# Altium schematic sheet Fri3D_2020_03.SchDoc: Top Level
size A3; Date: 06/06/2022; DrawnBy: Wim Van Gool; DocumentNumber: 1; Revision: 03; SheetNumber: 1; SheetTotal: 4
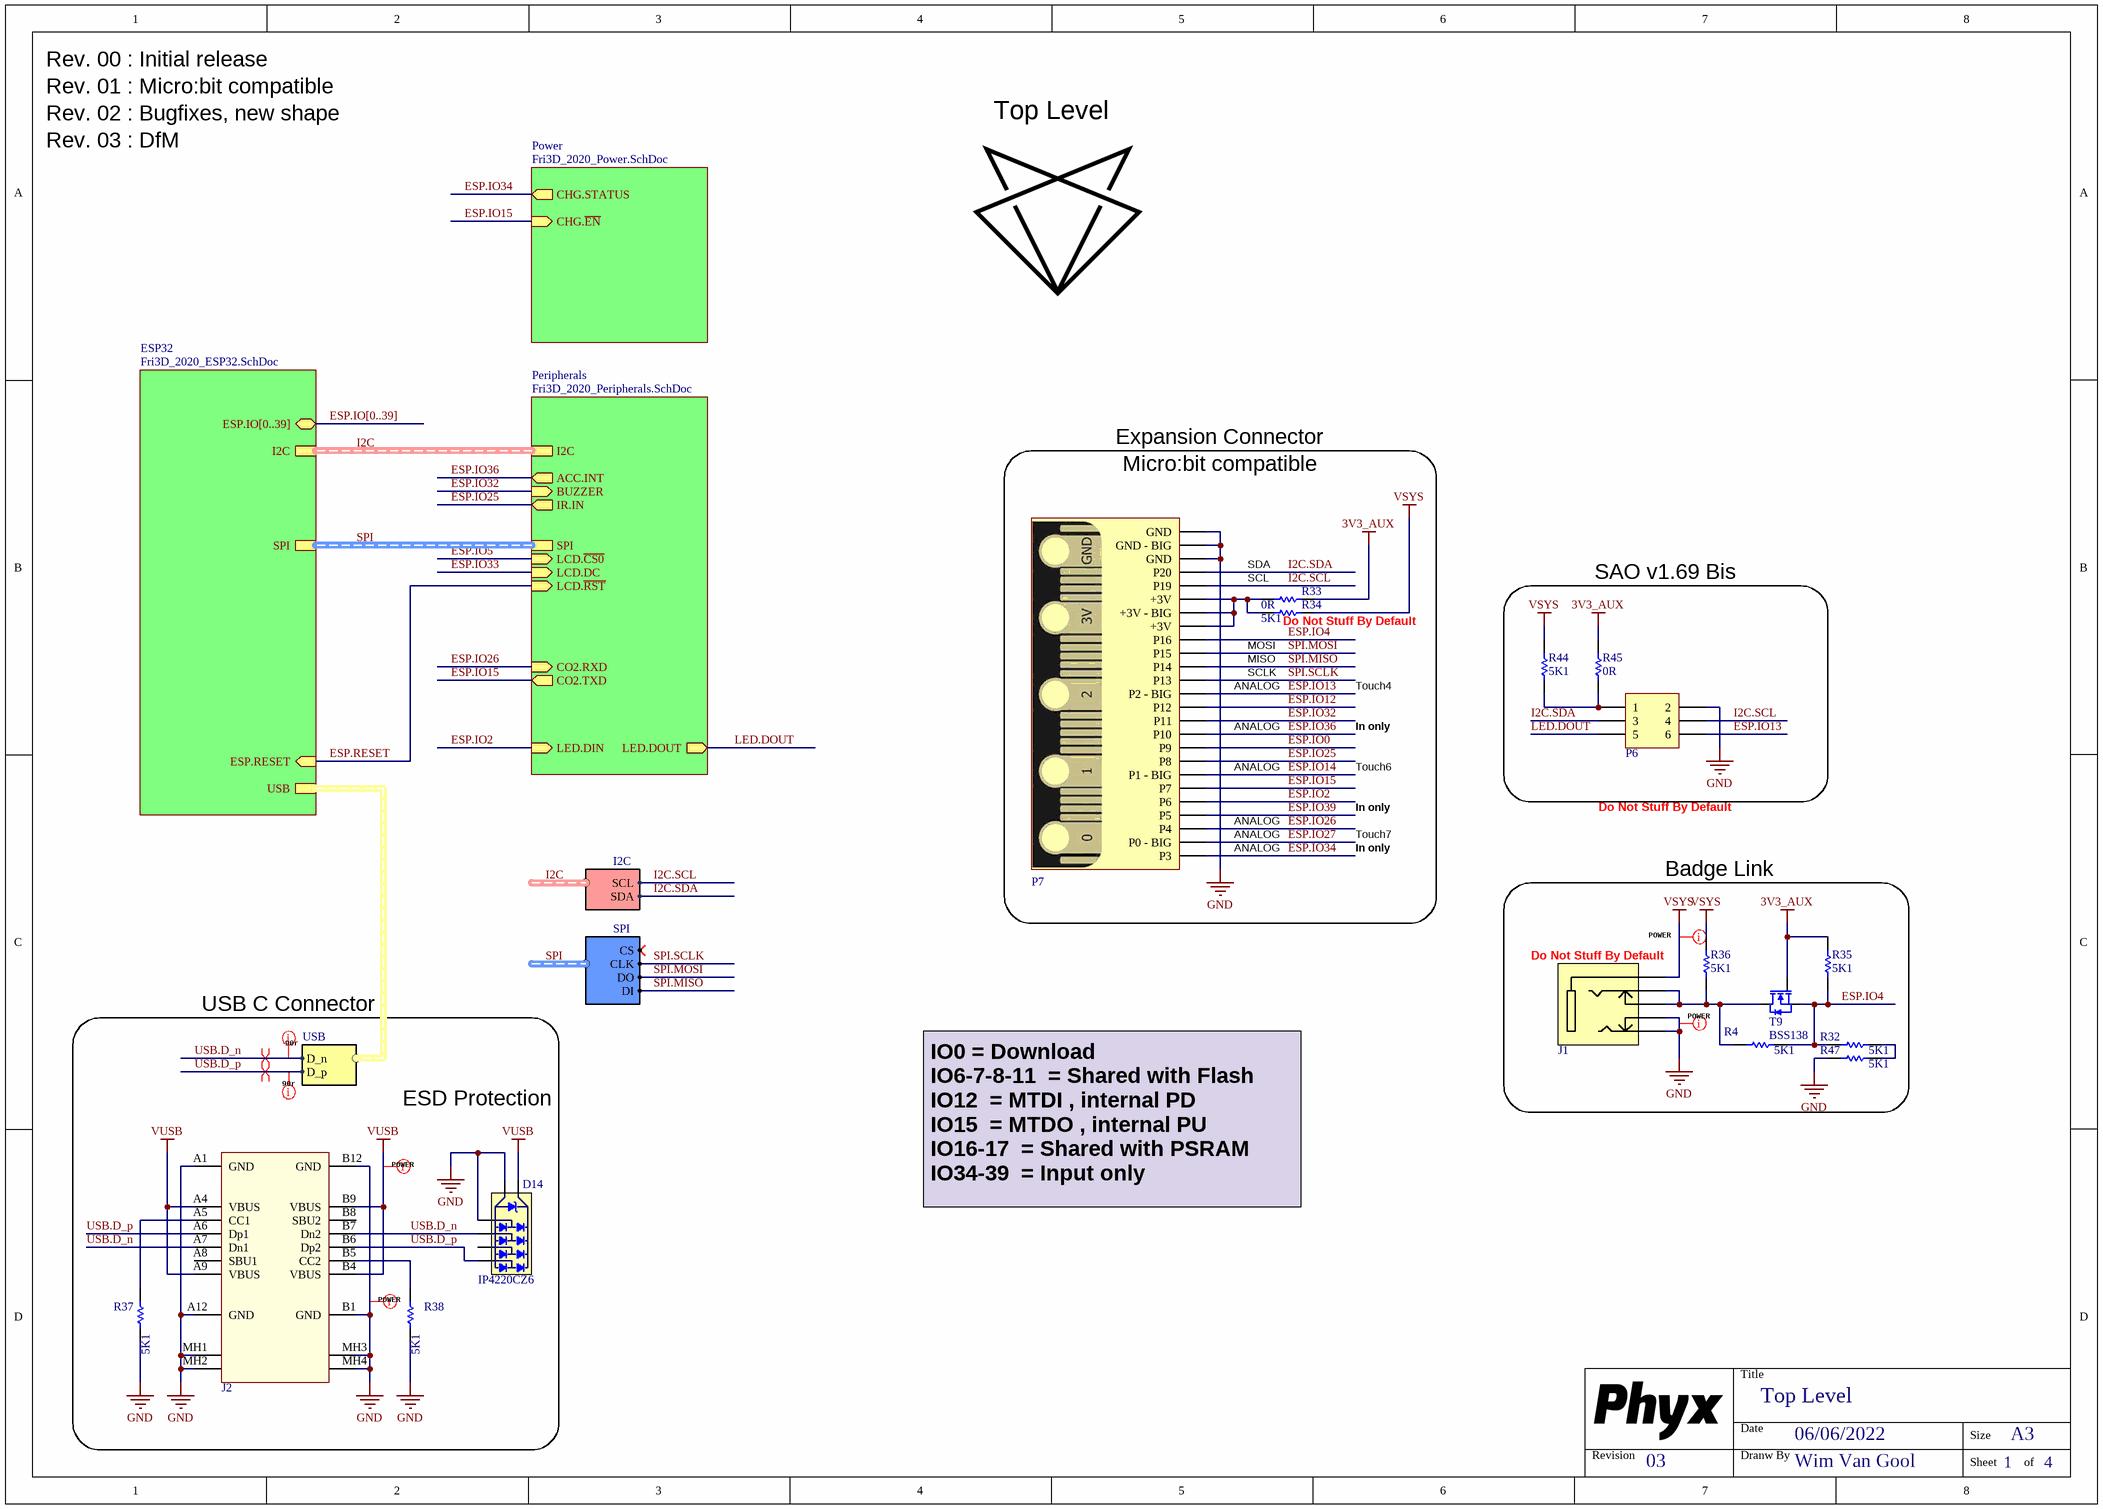
[diagram p0: Fri3D_2020_03.SchDoc]

## Parts
D14  value IP4220CZ6  [NXP_SOT457]  (hidden comment: TVS Diode Dual USB)
J1  3.5mm jack, dual switch, black, 3 contacts  [CUI_SJ1-3525NG]  (value not drawn)
J2  USB 2.0 C Reversible Receptacle Horizontal  [HRO_TYPE-C-31-M-12]  (value not drawn)
P6  Receptacle 3x2  [RCPT2X3]  (value not drawn)
P7  MicroBit PCB connector  [MicroBIT_V2_PCB]  (value not drawn)
R4  value 5K1  [R0603_N]  (hidden comment: RESISTOR)
R32  value 5K1  [R0603_N]  (hidden comment: RESISTOR)
R33  value 0R  [R0603_N]  (hidden comment: RESISTOR)
R34  value 5K1  [R0603_N]  (hidden comment: RESISTOR)
R35  value 5K1  [R0603_N]  (hidden comment: RESISTOR)
R36  value 5K1  [R0603_N]  (hidden comment: RESISTOR)
R37  value 5K1  [R0603_N]  (hidden comment: RESISTOR)
R38  value 5K1  [R0603_N]  (hidden comment: RESISTOR)
R44  value 5K1  [R0603_N]  (hidden comment: RESISTOR)
R45  value 0R  [R0603_N]  (hidden comment: RESISTOR)
R47  value 5K1  [R0603_N]  (hidden comment: RESISTOR)
T9  value BSS138  [SOT23-3]  (hidden comment: 0.2A N-Ch MOSFET Vgs 3.2)

## Blocks framed on the sheet
SAO v1.69 Bis: P6 R44 R45
Badge Link: J1 R4 R32 R35 R36 R47 T9

## Sub-sheets
ESP32 = Fri3D_2020_ESP32.SchDoc: I2C (harness I2C), USB (harness USB), SPI (harness SPI), ESP.RESET (in), ESP.IO[0..39] (bidir)
Peripherals = Fri3D_2020_Peripherals.SchDoc: I2C (harness I2C), ACC.INT (out), BUZZER (in), LED.DIN (in), LED.DOUT (out), SPI (harness SPI), IR.IN (out), LCD.DC (in), LCD.~{RST} (in), LCD.~{CS0} (in), CO2.TXD (out), CO2.RXD (in)
Power = Fri3D_2020_Power.SchDoc: CHG.STATUS (out), CHG.~{EN} (in)

## Harnesses
USB: D_p, D_n
I2C: SDA, SCL
SPI: CS, CLK, DO, DI

## Nets
3V3_AUX: R33.1 R35.1 R45.1 T9.1(G)
GND: D14.2(GND) D14.3 J1.2(Tip) J1.4 J2.A1(GND) J2.A12(GND) J2.B1(GND) J2.B12(GND) J2.MH1(Tab) J2.MH2(Tab) J2.MH3(Tab) J2.MH4(Tab) P6.2 P7.23(GND) P7.24(GND_-_BIG) P7.25(GND) R37.2 R38.2 R47.2
VSYS: J1.1(Sleeve) R34.2 R36.1 R44.2
VUSB: D14.5(VBus) J2.A4(VBUS) J2.A9(VBUS) J2.B4(VBUS) J2.B9(VBUS)
ESP.IO0: P7.9(P9)
ESP.IO2: P7.5(P6) ; sheet Peripherals/LED.DIN
ESP.IO4: P7.17(P16) R4.1 R32.2 R35.2 T9.2(S)
ESP.IO5: sheet Peripherals/LCD.~{CS0}
ESP.IO12: P7.12(P12)
ESP.IO13: P6.6 P7.13(P2_-_BIG)
ESP.IO14: P7.7(P1_-_BIG)
ESP.IO15: P7.6(P7) ; sheet Peripherals/CO2.TXD, sheet Power/CHG.~{EN}
ESP.IO25: P7.8(P8) ; sheet Peripherals/IR.IN
ESP.IO26: P7.3(P4) ; sheet Peripherals/CO2.RXD
ESP.IO27: P7.2(P0_-_BIG)
ESP.IO32: P7.11(P11) ; sheet Peripherals/BUZZER
ESP.IO33: sheet Peripherals/LCD.DC
ESP.IO34: P7.1(P3) ; sheet Power/CHG.STATUS
ESP.IO36: P7.10(P10) ; sheet Peripherals/ACC.INT
ESP.IO39: P7.4(P5)
ESP.RESET: sheet Peripherals/LCD.~{RST}, sheet ESP32/ESP.RESET
I2C.SCL: P6.4 P7.21(P19) ; sheet Peripherals/I2C.SCL
I2C.SDA: P6.3 P7.22(P20) ; sheet Peripherals/I2C.SDA
LED.DOUT: P6.5 ; sheet Peripherals/LED.DOUT
SPI.MISO: P7.15(P14) ; sheet Peripherals/SPI.DI  [project net SPI.DI]
SPI.MOSI: P7.16(P15) ; sheet Peripherals/SPI.DO  [project net SPI.DO]
SPI.SCLK: P7.14(P13) ; sheet Peripherals/SPI.CLK  [project net SPI.CLK]
USB.D_n: D14.1 J2.A7(Dn1) J2.B7(Dn2) ; sheet ESP32/USB.D_n
USB.D_p: D14.6 J2.A6(Dp1) J2.B6(Dp2) ; sheet ESP32/USB.D_p
NetJ1_3: J1.3(Ring) J1.5 R4.2 R36.2 T9.3(D)
NetJ2_A5: J2.A5(CC1) R37.1
NetJ2_B5: J2.B5(CC2) R38.1
NetP6_1: P6.1 R44.1 R45.2
NetP7_18: P7.18(+3V) P7.19(+3V_-_BIG) P7.20(+3V) R33.2 R34.1
NetR32_1: R32.1 R47.1

Not connected (* = marked no-connect by the designer): D14 4; J2 A8(SBU1) B8(SBU2)

## Buses and harness runs
bus ESP.IO[0..39] = sheet ESP32/ESP.IO[0..39]
harness I2C = sheet ESP32/I2C = sheet Peripherals/I2C
harness SPI = sheet ESP32/SPI = sheet Peripherals/SPI

## Layout directives
net class 90r: USB.D_n, USB.D_p
differential pair: USB.D_n, USB.D_p
net class POWER: GND, VSYS, VUSB

## Notes on the sheet
- Rev. 00 : Initial release
- Rev. 01 : Micro:bit compatible
- Rev. 02 : Bugfixes, new shape
- Rev. 03 : DfM
- Expansion Connector
- Micro:bit compatible
- SDA
- SCL
- MOSI
- (near R34) Do Not Stuff By Default
- ANALOG
- MISO
- SCLK
- Touch4
- Touch6
- In only
- Touch7
- Do Not Stuff By Default
- (near J1) Do Not Stuff By Default
- USB C Connector
- ESD Protection
- IO0	= Download
  IO6-7-8-11 	= Shared with Flash
  IO12 	= MTDI , internal PD
  IO15 	= MTDO , internal PU
  IO16-17 	= Shared with PSRAM
  IO34-39 	= Input only
- Title
- Revision
- Date
- Dranw By
- Size
- A3
- Sheet
- of

## Library data of the parts
D14 = TVS # IP4220CZ6 Dual USB: =Description; Supplier 1: Farnell; Supplier Part Number 1: 2143248
J1 = AUDIO JACK 3.5 3c SJ1-3525NG: =Description; Value: SJ1-3525NG; Supplier 1: Digi-key; Supplier Part Number 1: CP1-3525NG-ND
J2 = USB # C 2.0 RCPT TYPE-C-31-M-12: Value: TYPE-C-31-M-12; Supplier 1: China; Supplier Part Number 1: HRO TYPE-C-31-M-12; Supplier 2: LCSC; Supplier Part Number 2: C165948; Supplier 3: LCSC ALT; Supplier Part Number 3: C167321 / C319148
P6 = Receptacle 2.54mm dual row 6way
P7 = MicroBit # PCB part: Supplier 1: NO PART
R4 R32 R34-R38 R44 R47 = RES # 5K1 0603: Supplier 1: Farnell; Supplier Part Number 1: 2845922
  R4 R36: Supplier 2: LCSC; Supplier Part Number 2: C112314; Supplier 3: Generic; Supplier Part Number 3: 5K1 1% 0603
R33 R45 = RES # 0R 0603: Supplier 1: Farnell; Supplier Part Number 1: 2447743; Supplier 3: Generic; Supplier Part Number 3: 0R 1% 0603
T9 = BSS138 N-Ch MOSFET 0.2A 3.2Vgs 60Vds: Supplier 1: Farnell; Supplier Part Number 1: 2432717